# EAGLE design Freeduino4809 (EAGLE 7.7.0)

## Sheet 1 of 4
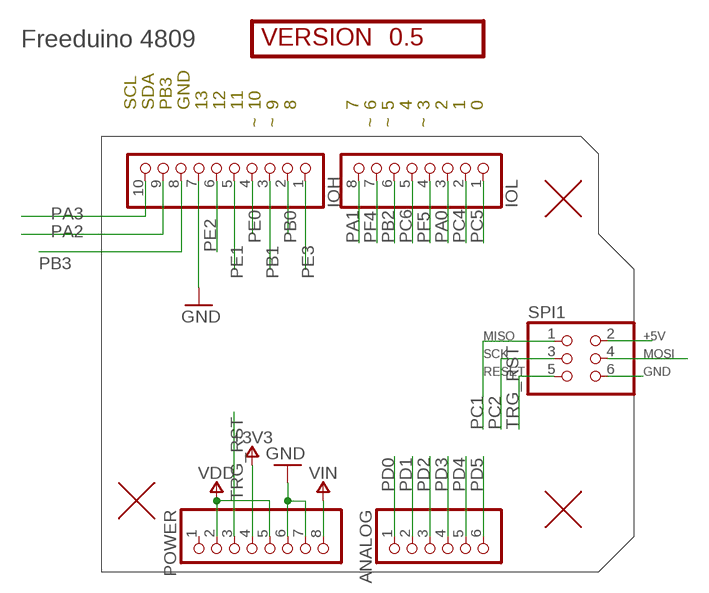
[diagram p0: schematic, sheet 1]

### Parts
ANALOG  Analog  PINHD-1X06TH  [1X06-TH]
IOH  Digital  PINHD-1X10TH  [1X10]
IOL  Digital  PINHD-1X08-DIGITALTH  [1X08]
POWER  Power  PINHD-1X08-POWERTH  [1X08]
SPI1  -  PINHD-2X03-ICSPTH  [2X03]
U$1  FIDUCIAL1.5X3  [FIDUCIAL-1.5X3]
U$2  FIDUCIAL1.5X3  [FIDUCIAL-1.5X3]
U$3  FIDUCIAL1.5X3  [FIDUCIAL-1.5X3]
VERSION  0.5  VERSION  [VERSION-NUMBER]

### Nets
+3V3: POWER.4 ; also sheet 4
GND: IOH.7 POWER.6 POWER.7 SPI1.6 ; also sheet 2,3,4
PA0: IOL.3 ; also sheet 2
PA1: IOL.8 ; also sheet 2
PA2: IOH.9 ; also sheet 2
PA3: IOH.10 ; also sheet 2
PB0: IOH.2 ; also sheet 2
PB1: IOH.3 ; also sheet 2
PB2: IOL.6 ; also sheet 2
PB3: IOH.8 ; also sheet 2
PC0: SPI1.4 ; also sheet 2
PC1: SPI1.1 ; also sheet 2
PC2: SPI1.3 ; also sheet 2
PC4: IOL.2 ; also sheet 2
PC5: IOL.1 ; also sheet 2
PC6: IOL.5 ; also sheet 2
PD0: ANALOG.1 ; also sheet 2
PD1: ANALOG.2 ; also sheet 2
PD2: ANALOG.3 ; also sheet 2
PD3: ANALOG.4 ; also sheet 2
PD4: ANALOG.5 ; also sheet 2
PD5: ANALOG.6 ; also sheet 2
PE0: IOH.4 ; also sheet 2
PE1: IOH.5 ; also sheet 2
PE2: IOH.6 ; also sheet 2
PE3: IOH.1 ; also sheet 2
PF4: IOL.7 ; also sheet 2
PF5: IOL.4 ; also sheet 2
TRG_RST: POWER.3 SPI1.5 ; also sheet 2,3
VDD [power]: POWER.2 POWER.5 SPI1.2 ; also sheet 2,3,4
VIN_EXT [power]: POWER.8 ; supply symbol labelled VIN ; also sheet 4
Unconnected: POWER.1

### Notes on the sheet
- Freeduino 4809
- SCL | SDA | PB3 | GND | 13 | 12 | 11 | 10 | 9 | 8 | 7 | 6 | 5 | 4 | 3 | 2 | 1 | 0
- ~ | ~ | ~ | ~ | ~

## Sheet 2 of 4
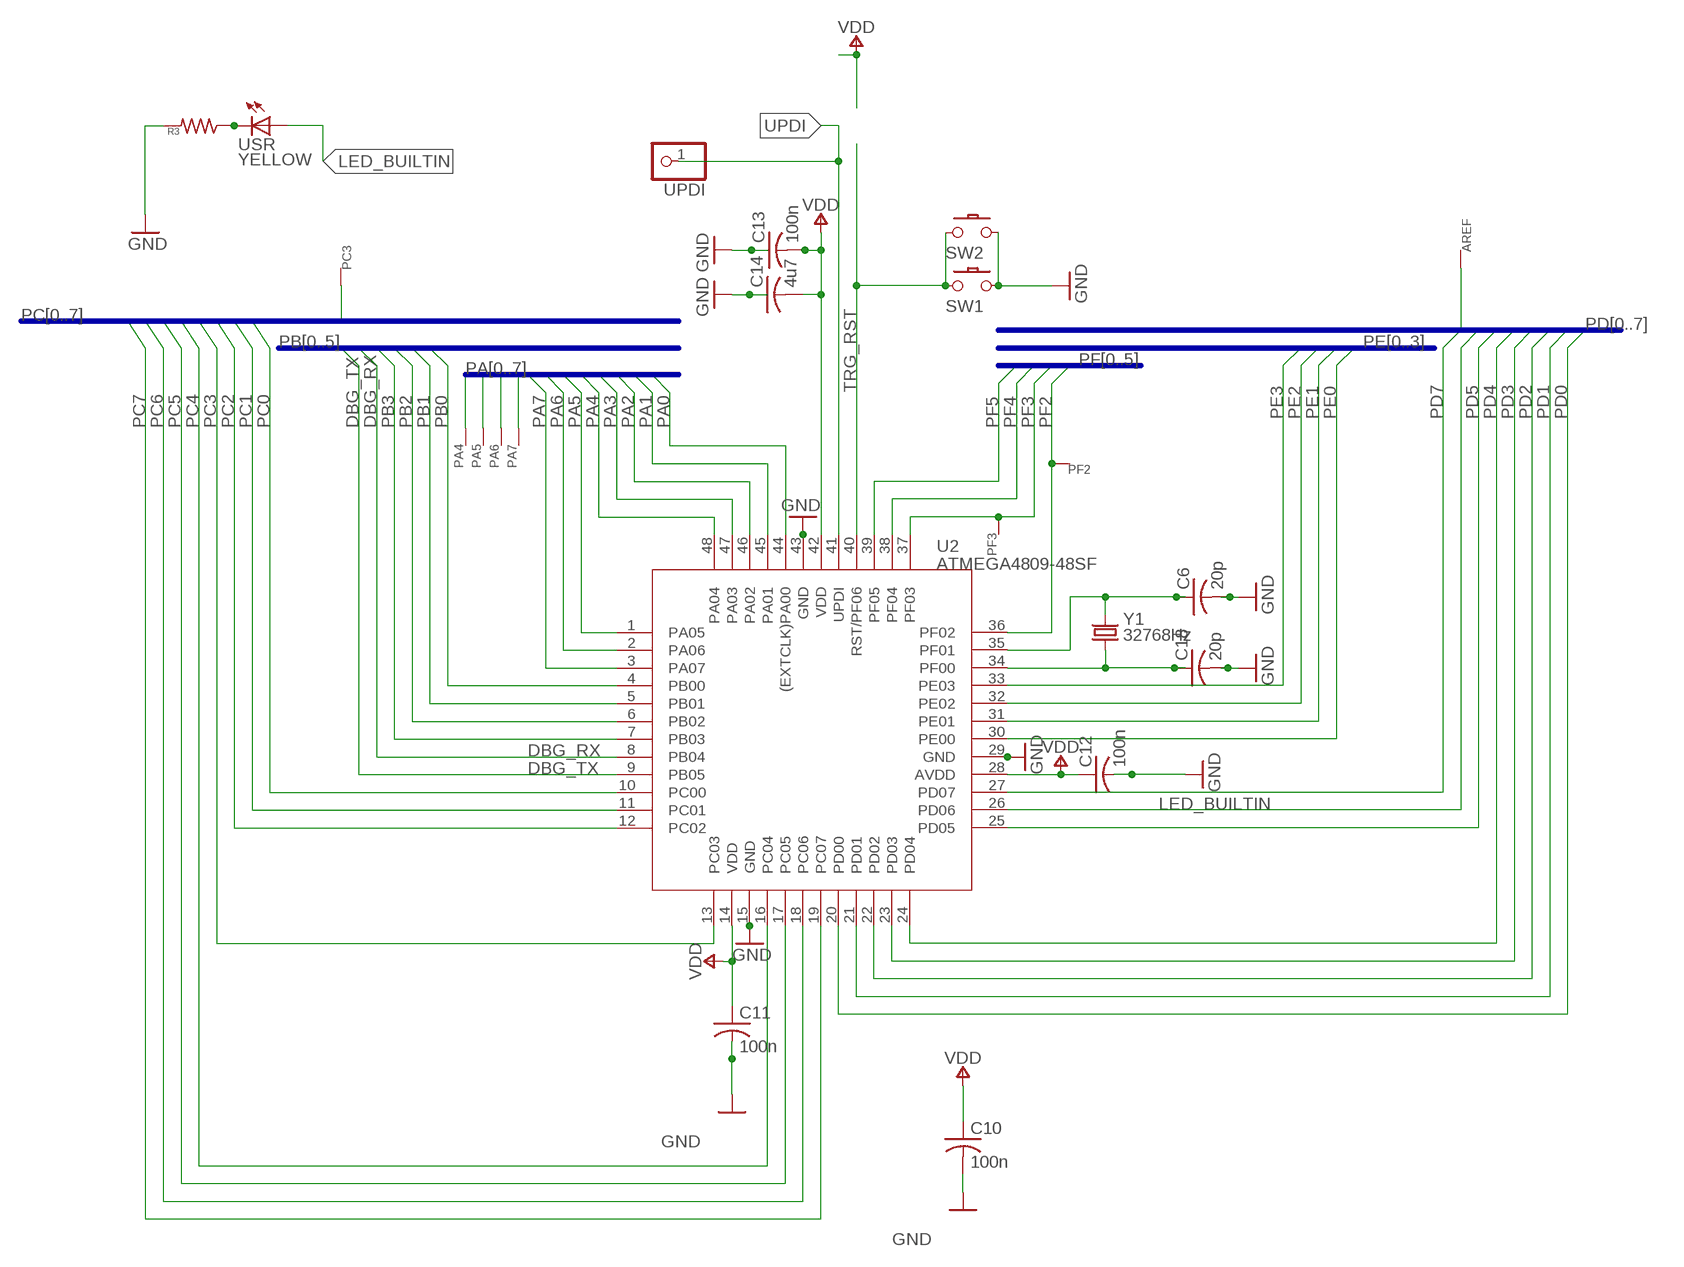
[diagram p1: schematic, sheet 2]

### Parts
AREF  WIRE-R10  [VIA10]
C6  20p  C-USC0805  [C0805]
C10  100n  C-USC0805  [C0805]
C11  100n  C-USC0805  [C0805]
C12  100n  C-USC0805  [C0805]
C13  100n  C-USC0805  [C0805]
C14  4u7  C-USC0805  [C0805]
C18  20p  C-USC0805  [C0805]
PA4  WIRE-R6  [VIA6]
PA5  WIRE-R6  [VIA6]
PA6  WIRE-R6  [VIA6]
PA7  WIRE-R6  [VIA6]
PC3  WIRE-R6  [VIA6]
PF2  WIRE-R6  [VIA6]
PF3  WIRE-R6  [VIA6]
R3  R-US_R0805  [R0805]
SW1  SW-PB2-NS/4MM  [SW-PB-SMT4MM]
SW2  SW-PB2-NSS52MM\  [SW-PB-SMT52MM]
U2  ATMEGA4809-48SF  [LQFP48-SPARKFUN]
UPDI  PINHD-1X1  [1X01]
USR  YELLOW  LED-YELLOW-0805  [CHIPLED_0805]
Y1  32768Hz  32.768KHZ  [ABS07]

### Nets
DBG_RX: U2.8(PB04) ; also sheet 3
DBG_TX: U2.9(PB05) ; also sheet 3
GND: C6.2 C10.2 C11.2 C12.2 C13.1 C14.1 C18.2 R3.2 SW1.P$4 SW2.S1 U2.15(GND) U2.29(GND) U2.43(GND) ; also sheet 1,3,4
LED_BUILTIN: U2.26(PD06) USR.A
N$4: C18.1 U2.34(PF00) Y1.1
N$5: C6.1 U2.35(PF01) Y1.2
N$22: R3.1 USR.C
PA0: U2.44((EXTCLK)PA00) ; also sheet 1
PA1: U2.45(PA01) ; also sheet 1
PA2: U2.46(PA02) ; also sheet 1
PA3: U2.47(PA03) ; also sheet 1
PA4: PA4.P$1 U2.48(PA04)
PA5: PA5.P$1 U2.1(PA05)
PA6: PA6.P$1 U2.2(PA06)
PA7: PA7.P$1 U2.3(PA07)
PB0: U2.4(PB00) ; also sheet 1
PB1: U2.5(PB01) ; also sheet 1
PB2: U2.6(PB02) ; also sheet 1
PB3: U2.7(PB03) ; also sheet 1
PC0: U2.10(PC00) ; also sheet 1
PC1: U2.11(PC01) ; also sheet 1
PC2: U2.12(PC02) ; also sheet 1
PC3: PC3.P$1 U2.13(PC03)
PC4: U2.16(PC04) ; also sheet 1
PC5: U2.17(PC05) ; also sheet 1
PC6: U2.18(PC06) ; also sheet 1
PC7: U2.19(PC07)
PD0: U2.20(PD00) ; also sheet 1
PD1: U2.21(PD01) ; also sheet 1
PD2: U2.22(PD02) ; also sheet 1
PD3: U2.23(PD03) ; also sheet 1
PD4: U2.24(PD04) ; also sheet 1
PD5: U2.25(PD05) ; also sheet 1
PD7: AREF.P$1 U2.27(PD07)
PE0: U2.30(PE00) ; also sheet 1
PE1: U2.31(PE01) ; also sheet 1
PE2: U2.32(PE02) ; also sheet 1
PE3: U2.33(PE03) ; also sheet 1
PF2: PF2.P$1 U2.36(PF02)
PF3: PF3.P$1 U2.37(PF03)
PF4: U2.38(PF04) ; also sheet 1
PF5: U2.39(PF05) ; also sheet 1
TRG_RST: SW1.P$2 SW2.C2 U2.40(RST/PF06) ; also sheet 1,3
UPDI: U2.41(UPDI) UPDI.1
VDD [power]: C10.1 C11.1 C12.1 C13.2 C14.2 U2.14(VDD) U2.28(AVDD) U2.42(VDD) ; also sheet 1,3,4

### Buses
PA[0..7]
PB[0..5]
PF[0..5]
PE[0..3]
PD[0..7]
PC[0..7]

## Sheet 3 of 4
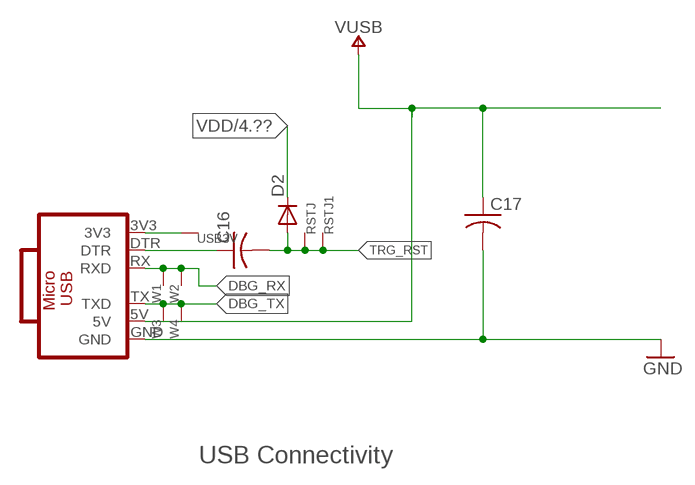
[diagram p2: schematic, sheet 3]

### Parts
C16  C-USC0805  [C0805]
C17  C-USC0805  [C0805]
D2  DIODE-SIGNAL-SOD323  [SOD323F]
RSTJ  WIRE-R6  [VIA6]
RSTJ1  WIRE-R6  [VIA6]
USB3V  WIRE-VIA8  [VIA8]
USBMOD  CH340E-MODNOHOLES  [CH340E-MOD-NOHOLES]
W1  WIRE-R6  [VIA6]
W2  WIRE-R6  [VIA6]
W3  WIRE-R6  [VIA6]
W4  WIRE-R6  [VIA6]

### Nets
DBG_RX: USBMOD.RX(RXD) W1.P$1 W2.P$1 ; also sheet 2
DBG_TX: USBMOD.TX(TXD) W3.P$1 W4.P$1 ; also sheet 2
DTR: C16.1 USBMOD.DTR
GND: C17.2 USBMOD.GND ; also sheet 1,2,4
TRG_RST: C16.2 D2.A RSTJ1.P$1 RSTJ.P$1 ; also sheet 1,2
USB3V: USB3V.P$1 USBMOD.3V3
VDD [power]: D2.C ; also sheet 1,2,4
VUSB: C17.1 USBMOD.5V ; also sheet 4

### Notes on the sheet
- USB Connectivity

## Sheet 4 of 4
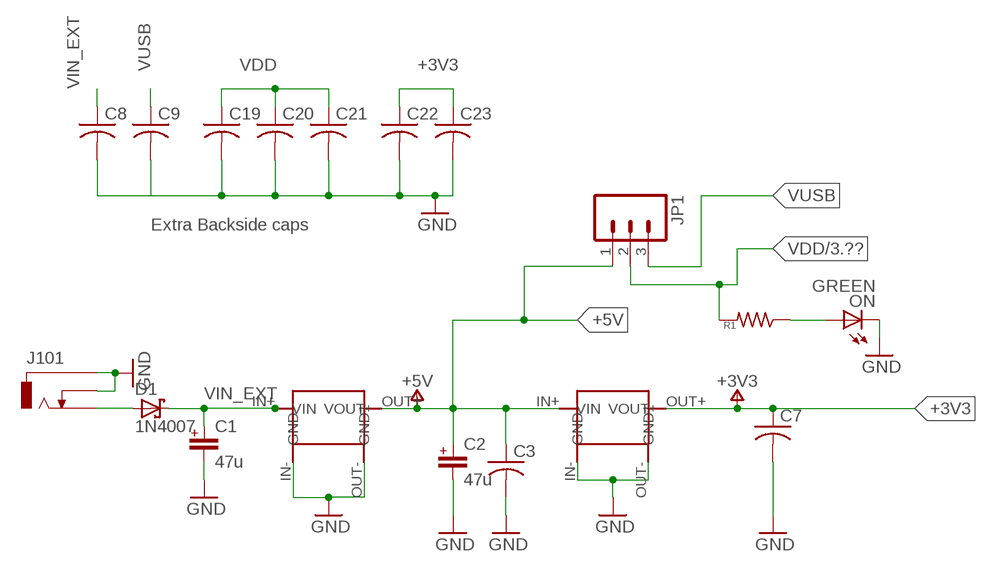
[diagram p3: schematic, sheet 4]

### Parts
C1  47u  C+-47UFPAN-D  [PANASONIC_D]
C2  47u  C+-47UFPAN-D  [PANASONIC_D]
C3  C-USC0805  [C0805]
C7  C-USC0805  [C0805]
C8  C-USC0805  [C0805]
C9  C-USC0805  [C0805]
C19  C-USC1206  [C1206]
C20  C-USC1206  [C1206]
C21  C-USC0805  [C0805]
C22  C-USC1206  [C1206]
C23  C-USC0805  [C0805]
D1  1N4007  D_SCHOTTKY-4007-SMB  [SMB_DO214AA]
J101  -  BARRELLG  [POWERSUPPLY_DC-21MM]
JP1  M03LOCK_LONGPADS  [1X03_LOCK_LONGPADS]
ON  GREEN  LED-GREEN-0805  [CHIPLED_0805]
R1  R-US_R0805  [R0805]
VREG-3V3  VREG-4-MOD  [VREG-4-11X17]
VREG-5V  VREG-4-MOD  [VREG-4-11X17]

### Nets
+3V3: C7.1 C22.1 C23.1 VREG-3V3.OUT+(VOUT) ; also sheet 1
+5V: C2.+ C3.1 JP1.1 VREG-3V3.IN+(VIN) VREG-5V.OUT+(VOUT)
GND: C1.- C2.- C3.2 C7.2 C8.2 C9.2 C19.2 C20.2 C21.2 C22.2 C23.2 J101.-1 J101.-2 J101.-3 J101.E1 J101.E2 J101.E3 ON.C VREG-3V3.IN-(GND) VREG-3V3.OUT-(GND1) VREG-5V.IN-(GND) VREG-5V.OUT-(GND1) ; also sheet 1,2,3
N$1: D1.A J101.+1 J101.+2 J101.+3
N$2: ON.A R1.1
VDD [power]: C19.1 C20.1 C21.1 JP1.2 R1.2 ; also sheet 1,2,3
VIN_EXT [power]: C1.+ C8.1 D1.C VREG-5V.IN+(VIN) ; also sheet 1
VUSB: C9.1 JP1.3 ; also sheet 3

### Notes on the sheet
- Extra Backside caps

## Library data of the parts
ANALOG = Arduino-connectors:PINHD-1X06: PIN HEADER; CODE-ARDUINO: 3649; DATASHEET: -; DISTRIBUTOR-LINK: -; DISTRIBUTOR-PN: -; MANUFACTURER: -; MANUFACTURER-PN: FH254-106DF085149V
AREF PA4-PA7 PC3 PF2 PF3 RSTJ RSTJ1 USB3V W1-W4 = mylib4:WIRE: Pad for a wire offboard
C1 C2 = Arduino-rcl:C+: Polarized Capacitor; CODE-ARDUINO: 0113; DATASHEET: https://industrial.panasonic.com/cdbs/www-data/pdf/RDE0000/DME0000COL90.pdf; DISTRIBUTOR-LINK: https://www.digikey.com/product-detail/en/panasonic-electronic-components/EEE-1EA470WP/PCE3908CT-ND/766284; DISTRIBUTOR-PN: PCE3908CT-ND; MANUFACTURER: Panasonic; MANUFACTURER-PN: EEE-1EA470WP; PN-ALTERNATIVE1: TS13C01E470MET000R
C3 C6-C14 C16-C23 = my-rcl:C-US: CAPACITOR, American symbol
D1 = Arduino-diodes:D_SCHOTTKY: Schottky Diodes; CODE-ARDUINO: 0020; DATASHEET: www.comchiptech.com/cms/UserFiles/CGRA4001-G%20Thru.%20CGRA4007-HF%20RevD.pdf; DISTRIBUTOR-LINK: https://www.digikey.com/product-detail/en/comchip-technology/CGRA4007-G/641-1018-1-ND/1121140; DISTRIBUTOR-PN: 641-1018-1-ND; MANUFACTURER: Comchip; MANUFACTURER-PN: CGRA4007-G; PN-ALTERNATIVE1: 1N4007SMA
D2 = mylib4:DIODE-SIGNAL
IOH = Arduino-connectors:PINHD-1X10: PIN HEADER; CODE-ARDUINO: 3648; DATASHEET: -; DISTRIBUTOR-LINK: -; DISTRIBUTOR-PN: -; MANUFACTURER: -; MANUFACTURER-PN: FH254-110DF085149V
IOL = Arduino-connectors:PINHD-1X08: PIN HEADER; CODE-ARDUINO: 3648; DATASHEET: -; DISTRIBUTOR-LINK: -; DISTRIBUTOR-PN: -; MANUFACTURER: -; MANUFACTURER-PN: FH254-108DF085149V
J101 = Arduino-connectors:BARREL: Power Barrel Connector Jack 2.10mm ID (0.083"), 5.50mm OD (0.217") Through Hole, Right Angle; CODE-ARDUINO: 0018; DATASHEET: http://www.mouser.com/ds/2/253/KC-301287-195995.pdf; DISTRIBUTOR-LINK: https://www.mouser.it/ProductDetail/Kobiconn/163-179PH-EX/?qs=Xb8IjHhkxj5l2UOaIqcGCw==; DISTRIBUTOR-PN: 163-179PH-EX; MANUFACTURER: Kobiconn; MANUFACTURER-PN: 163-179PH-EX
JP1 = SparkFun:M03: Header 3 Standard 3-pin 0.1" header. Use with straight break away headers (SKU : PRT-00116), right angle break away headers (PRT-00553), swiss pins (PRT-00743), machine pins (PRT-00117), and female headers (PRT-00115). Molex polarized connector foot print use with SKU : PRT-08232 with associated crimp pins and housings.
ON = Arduino-diodes:LED: LED; CODE-ARDUINO: 0043; DATASHEET: https://media.digikey.com/pdf/Data%20Sheets/Lite-On%20PDFs/LTST-C170GKT.pdf; DISTRIBUTOR-LINK: https://www.digikey.com/product-detail/it/lite-on-inc/LTST-C170GKT/160-1179-1-ND/269251; DISTRIBUTOR-PN: 160-1179-1-ND; MANUFACTURER: Lite-On; MANUFACTURER-PN: LTST-C170GKT; PN-ALTERNATIVE1: KPT-2012SGC
POWER = Arduino-connectors:PINHD-1X08: PIN HEADER; CODE-ARDUINO: 3649; DATASHEET: -; DISTRIBUTOR-LINK: -; DISTRIBUTOR-PN: -; MANUFACTURER: -; MANUFACTURER-PN: FH254-108DF085149V
R1 R3 = my-rcl:R-US_: RESISTOR, American symbol
SPI1 = Arduino-connectors:PINHD-2X03-ICSP: PIN HEADER; CODE-ARDUINO: 0114; DATASHEET: -; DISTRIBUTOR-LINK: https://www.digikey.com/product-detail/en/samtec-inc/TSW-103-25-S-D/TSW-103-25-S-D-ND/7863771; DISTRIBUTOR-PN: TSW-103-25-S-D-ND; MANUFACTURER: Samtec; MANUFACTURER-PN: TSW-103-25-S-D
SW1 SW2 = mylib4:SW-PB2-NS: SPST switch with no shield
U2 = avr:ATMEGA4809-48: ATMEGA4809
U$1-U$3 = SparkFunEagle-6-6-07:FIDUCIAL: Fiducial Alignment Points Various fiducial points for machine vision alignment.
UPDI = pinhead:PINHD-1X1: PIN HEADER
USBMOD = mini-usb:CH340E-MOD
USR = Arduino-diodes:LED: LED; CODE-ARDUINO: 0044; DATASHEET: https://media.digikey.com/pdf/Data%20Sheets/Lite-On%20PDFs/LTST-C170GKT.pdf; DISTRIBUTOR-LINK: https://www.digikey.com/product-detail/it/lite-on-inc/LTST-C170YKT/160-1175-1-ND/269247; DISTRIBUTOR-PN: 160-1175-1-ND; MANUFACTURER: Lite-On; MANUFACTURER-PN: LTST-C170YKT; PN-ALTERNATIVE1: KPT-2012YC
VERSION = mylib4:VERSION: Version number for drawings
VREG-3V3 VREG-5V = mylib4:VREG-4-MOD
Y1 = Arduino-crystals:32.768KHZ: LF crystal; CODE-ARDUINO: 0213; DATASHEET: http://www.abracon.com/Resonators/ABS07.pdf; DISTRIBUTOR-LINK: http://www.digikey.com/product-detail/en/abracon-llc/ABS07-32.768KHZ-T/535-9542-1-ND/1237009; DISTRIBUTOR-PN: 535-9542-1-ND; MANUFACTURER: Abracon LLC; MANUFACTURER-PN: ABS07-32.768KHZ-T

## Net classes
0 default: width 0.2 mm, drill 0.5 mm
1 power: width 0.6 mm

## Board
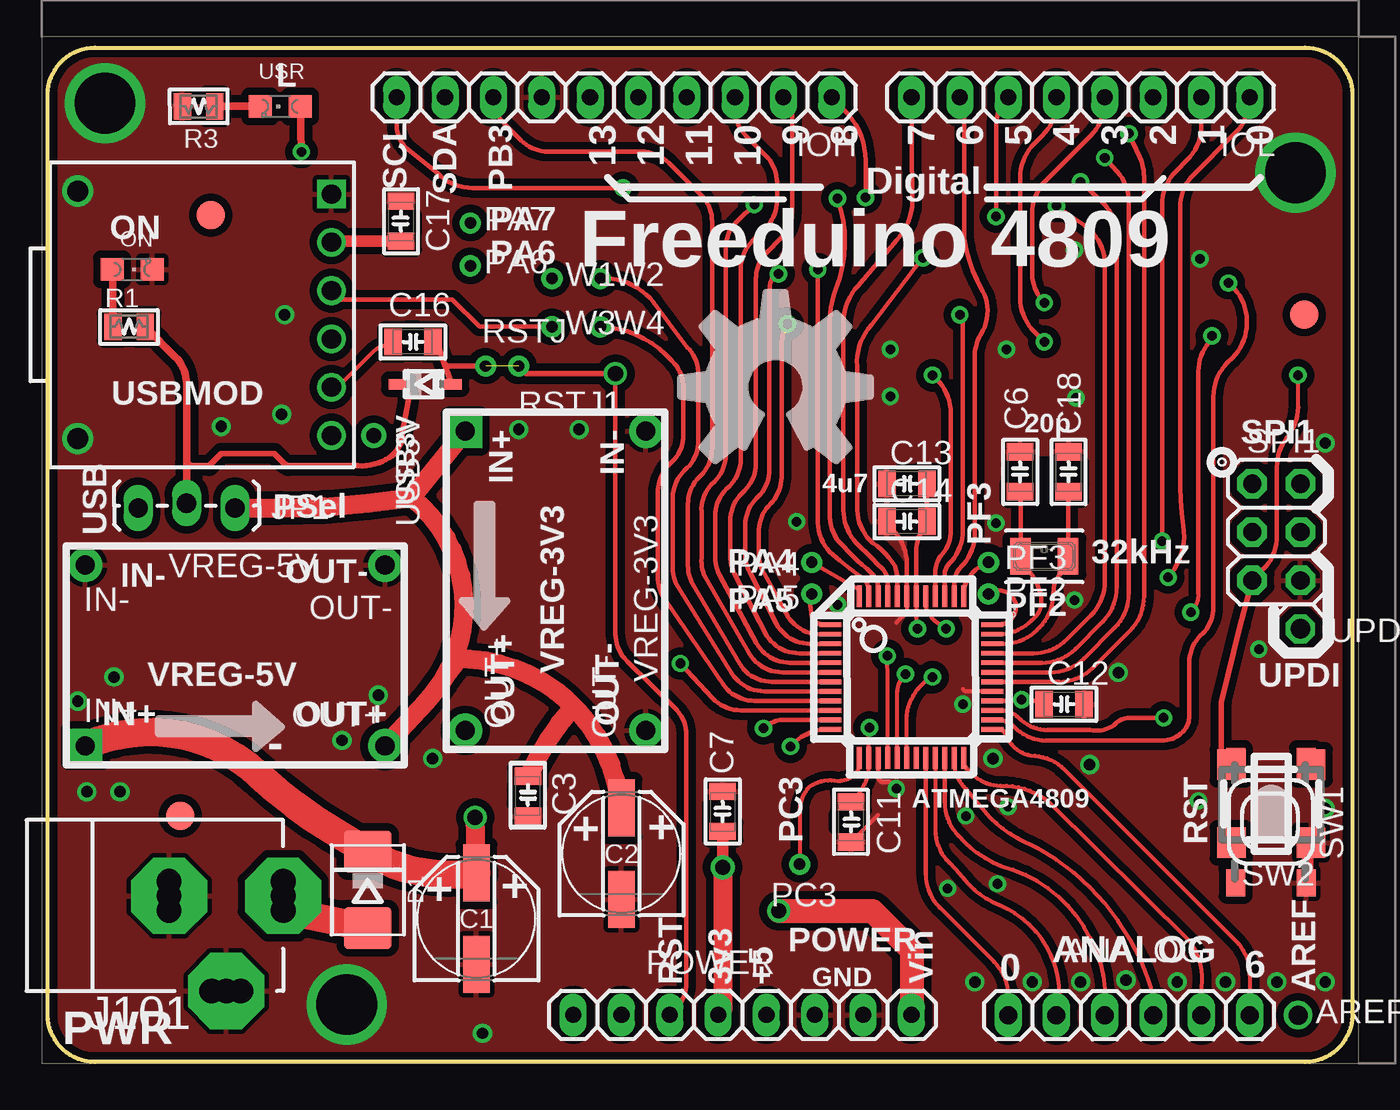
[diagram p4: board, top side]
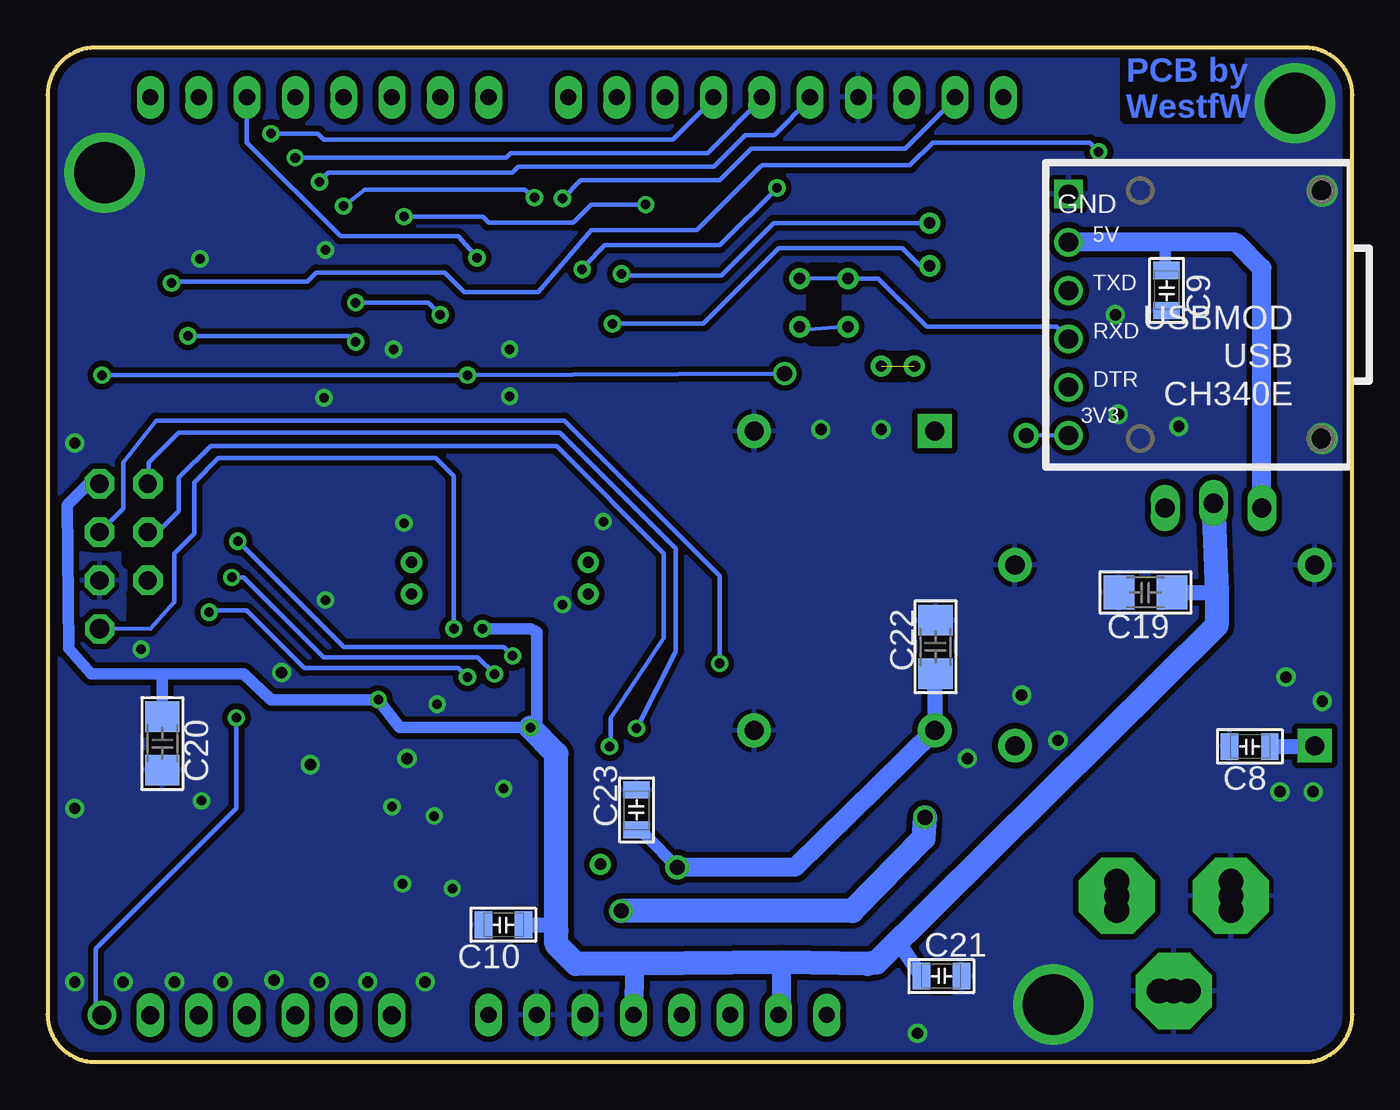
[diagram p5: board, bottom side, seen from below]

Size 68.58 x 53.34 mm. Coordinates in mm from the lower left corner, seen from the top.
Outline: 0,50.84 arc-90 2.5,53.34 66.08,53.34 arc-90 68.58,50.84 68.58,2.5 arc-90 66.08,0 2.5,0 arc-90 0,2.5 0,50.84
Copper layers (1*16): Top 0.035mm / dielectric 1.5mm / Bottom 0.035mm
Design rules "default *": minimum track width 8mil, minimum drill 0.3mm, track to track 6mil, track to pad 6mil, pad to pad 6mil, via to via 6mil, smd to smd 6mil, copper to edge 16mil, drill to drill 8mil, minimum pad ring 10mil, minimum via ring 8mil, stop-mask expansion 2mil, vias tented up to drill 0.55mm, thermal gap 10mil
tRestrict: area 52.1,25.6 to 52.8,30.5; area 50.5,30.7 to 51.8,31.4; area 53,30.8 to 54.4,31.5; area 51.8,30.7 to 53.1,31.4; area 44.8,29.7 to 45.5,31; area 44.8,27.8 to 45.6,29.1; area 18.8,37.2 to 19.5,38.6; area 17.9,43.8 to 19.3,44.5; area 34.8,12.8 to 36.1,13.5; area 41.4,12.3 to 42.8,13; area 24.5,13.6 to 25.9,14.3; area 3.9,38 to 4.6,39.3; area 53.1,18.2 to 53.8,19.5; area 53,18.1 to 53.7,19.4
bRestrict: area 10.5,24 to 11.3,25.2; area 9,40.1 to 10.3,40.9; area 4.9,16 to 5.7,17.2; area 21.3,21.5 to 22.5,22.3; area 21.2,3.8 to 22,5.1; area 37,12.9 to 38.3,13.7; area 44.2,6.6 to 45,7.9; area 61.8,16.4 to 63.1,17.1; area 30.7,4.6 to 37.1,5.6; area 23.6,36 to 24.4,37.1; area 27.1,37.9 to 28.4,41.8; 6 lines

### Footprints (pad centres in the part's own frame; a part is rotated, then mirrored left to right if it is on the bottom)
1X06-TH = drill 0.95 pad 1.422 long: 1 -6.35,0; 2 -3.81,0; 3 -1.27,0; 4 1.27,0; 5 3.81,0; 6 6.35,0
VIA10 = drill 1: P$1 0,0
PANASONIC_D = smd 3 x 1.4: + 2.4,0; - -2.4,0
C0805 = smd 0.914 x 1.397: 1 -1.053,0; 2 1.053,0
C1206 = smd 1.6 x 1.8: 1 -1.4,0; 2 1.4,0
SMB_DO214AA = smd 2.2 x 2.5: A -2,0; C 2,0
SOD323F = smd 0.55 x 1.05: A 0,-1.4; C 0,1.4
1X10 = drill 0.85 pad 1.422 long: 1 -11.43,0; 2 -8.89,0; 3 -6.35,0; 4 -3.81,0; 5 -1.27,0; 6 1.27,0; 7 3.81,0; 8 6.35,0; 9 8.89,0; 10 11.43,0
1X08 = drill 0.85 pad 1.422 long: 1 -8.89,0; 2 -6.35,0; 3 -3.81,0; 4 -1.27,0; 5 1.27,0; 6 3.81,0; 7 6.35,0; 8 8.89,0
POWERSUPPLY_DC-21MM = drill 1.3 pad 4 octagon: +1 -0.076,-6.35; -1 -0.076,-0.356; E1 -5.08,-3.353 | drill 1.3: +2 -0.838,-6.35; +3 0.686,-6.35; -2 -0.838,-0.356; -3 0.686,-0.356; E2 -5.08,-2.591; E3 -5.08,-4.115
1X03_LOCK_LONGPADS = drill 1.016 long: 1 0,0; 2 2.54,-0.254; 3 5.08,0
CHIPLED_0805 = smd 1.2 x 1.2: A -1.05,0; C 1.05,0
VIA6 = drill 0.6: P$1 0,0
R0805 = smd 0.914 x 1.397: 1 -0.85,0; 2 0.85,0
2X03 = drill 0.95 pad 1.55 octagon: 1 2.54,1.27; 2 2.54,-1.27; 3 0,1.27; 4 0,-1.27; 5 -2.54,1.27; 6 -2.54,-1.27
SW-PB-SMT4MM = smd 1.4 x 1: P$1 -3.2,1.85; P$2 -3.2,-1.85; P$3 3.2,-1.85; P$4 3.2,1.85
SW-PB-SMT52MM = smd 1.5 x 1.6: C1 2.1,2.05; C2 2.1,-2.05; S1 -2.1,2.05; S2 -2.1,-2.05
LQFP48-SPARKFUN = smd 0.254 x 1.143: 1 -2.75,-4.25; 2 -2.25,-4.25; 3 -1.75,-4.25; 4 -1.25,-4.25; 5 -0.75,-4.25; 6 -0.25,-4.25; 7 0.25,-4.25; 8 0.75,-4.25; 9 1.25,-4.25; 10 1.75,-4.25; 11 2.25,-4.25; 12 2.75,-4.25; 25 2.75,4.25; 26 2.25,4.25; 27 1.75,4.25; 28 1.25,4.25; 29 0.75,4.25; 30 0.25,4.25; 31 -0.25,4.25; 32 -0.75,4.25; 33 -1.25,4.25; 34 -1.75,4.25; 35 -2.25,4.25; 36 -2.75,4.25 | smd 1.143 x 0.254: 13 4.25,-2.75; 14 4.25,-2.25; 15 4.25,-1.75; 16 4.25,-1.25; 17 4.25,-0.75; 18 4.25,-0.25; 19 4.25,0.25; 20 4.25,0.75; 21 4.25,1.25; 22 4.25,1.75; 23 4.25,2.25; 24 4.25,2.75; 37 -4.25,2.75; 38 -4.25,2.25; 39 -4.25,1.75; 40 -4.25,1.25; 41 -4.25,0.75; 42 -4.25,0.25; 43 -4.25,-0.25; 44 -4.25,-0.75; 45 -4.25,-1.25; 46 -4.25,-1.75; 47 -4.25,-2.25; 48 -4.25,-2.75
FIDUCIAL-1.5X3 = smd 1.5 x 1.5: 1 0,0
1X01 = drill 1.016 octagon: 1 0,0
VIA8 = drill 0.8: P$1 0,0
CH340E-MOD-NOHOLES = drill 1: 3V3 6.35,6.35; 5V 6.35,-3.81; DTR 6.35,3.81; RX 6.35,1.27; TX 6.35,-1.27 | drill 1 square: GND 6.35,-6.35
VREG-4-11X17 = drill 1 pad 1.778 square: IN+ -5,-2.5 | drill 1 pad 1.778: IN- -5,7; OUT+ 10.75,-2.5; OUT- 10.75,7
ABS07 = smd 1.1 x 1.9: 1 -1.25,0; 2 1.25,0

### Placement (x,y rotation side)
ANALOG  56.83,2.46 0 top
AREF  65.72,2.46 0 top
C1  22.54,7.54 90 top
C2  30.16,10.95 90 top
C3  25.24,13.97 270 top
C6  51.12,31.04 90 top
C7  35.48,13.18 90 top
C8  5.4,16.59 180 bottom
C9  9.76,40.56 270 bottom
C10  44.63,7.21 180 bottom
C11  42.23,12.62 270 top
C12  53.42,18.81 0 top
C13  45.16,30.4 0 top
C14  45.16,28.42 0 top
C16  19.21,37.86 0 top
C17  18.57,44.21 90 top
C18  53.66,31.04 90 top
C19  10.87,24.69 180 bottom
C20  62.55,16.75 270 bottom
C21  21.6,4.52 0 bottom
C22  21.91,21.83 90 bottom
C23  37.62,13.26 90 bottom
D1  16.83,9.05 90 top
D2  19.84,35.64 90 top
IOH  29.78,50.72 180 top
IOL  54.29,50.72 180 top
J101  6.03,8.81 90 top
JP1  9.84,29.13 180 top
ON  4.45,41.67 0 top
PA4  40.16,26.27 0 top
PA5  40.16,24.61 0 top
PA6  22.23,41.86 0 top
PA7  22.23,44.12 0 top
PC3  39.53,10.4 0 top
PF2  49.45,24.61 0 top
PF3  49.45,26.27 0 top
POWER  36.51,2.47 0 top
R1  4.29,38.66 0 top
R3  7.94,50.24 180 top
RSTJ  23.02,36.59 0 top
RSTJ1  24.77,36.59 0 top
SPI1  64.58,27.86 90 top
SW1  64.29,12.62 270 top
SW2  64.31,13.58 180 top
U2  45.4,20.24 270 top
U$1  6.99,12.94 0 top
U$2  66.04,39.29 0 top
U$3  8.57,44.53 0 top
UPDI  65.85,22.78 0 top
USB3V  17.14,32.94 0 top
USBMOD  8.57,39.29 180 bottom
USR  12.22,50.24 180 top
VERSION  33.03,57.96 0 top  (outside the outline)
VREG-3V3  24.45,28.18 270 top
VREG-5V  6.99,19.13 0 top
W1  26.51,41.2 0 top
W2  29.05,41.2 0 top
W3  26.51,38.66 0 top
W4  29.05,38.66 0 top
Y1  52.39,26.59 180 top

### Tracks (layer width: path | path; a pad name or v marks a point on that pad's centre or on a via)
+3V3  (via drill 0.8 pad 1.27)
  Top 0.6: C7.1 v35.48,10.24
  Top 1: v35.48,10.24 35.48,2.71 POWER.4
  Bottom 0.6: C22.1 arc-90 21.95,19.46 | C23.1 37.13,11.88 v35.48,10.24
  Bottom 0.8: 21.95,19.46 VREG-3V3.OUT+
  Bottom 1: VREG-3V3.OUT+ 29.29,10.24 v35.48,10.24
+5V
  Top 0.6: 29.85,14.84 28.34,17.86 27.54,18.57 | 30.24,13.33 C2.+
  Top 1: C2.+ 30.24,13.35 | JP1.1 12.22,29.13 arc9 19.13,29.69 | VREG-5V.OUT+ 19.92,18.97 | 19.92,18.97 arc95 19.13,29.69 | 19.13,29.69 VREG-3V3.IN+ | 30.24,13.33 29.85,14.84 arc77 21.35,21.19 21.35,20.88 19.92,18.97 | C3.1 25.4,15.24 arc-17 27.54,18.57
DBG_RX
  Top 0.229: W2.P$1 arc-55 31.86,39.93 33.62,37.57 arc-45 34.21,36.16 34.21,32.66 arc-45 33.62,31.24 33.45,31.07 arc45 32.86,29.65 32.86,25.97 arc32 33.16,24.91 35.96,20.43 arc58 37.66,19.49 U2.8
  Bottom 0.2: W1.P$1 W2.P$1
  Bottom 0.229: W1.P$1 24.92,41.2 22.38,38.66 15.56,38.66 USBMOD.RX
DBG_TX
  Top 0.229: W4.P$1 arc-48 32.83,36.86 arc-45 33.42,35.45 33.42,32.98 arc-45 32.83,31.56 32.73,31.46 arc45 32.07,30.05 32.07,25.38 arc34 32.5,24.25 35.5,19.86 arc56 37.15,18.99 U2.9 | W3.P$1 22.7,38.66 21.27,40.08 15.4,40.08 USBMOD.TX
  Bottom 0.2: W3.P$1 28.58,38.51 arc-90 W4.P$1
DTR
  Top 0.203: USBMOD.DTR 15.24,35.48 17.08,37.33 arc-45 18,37.7 C16.1
GND  (via drill 0.5, 0.6, 1.1, 3.2)
  Top 0.203: 43.65,12.99 C11.2 | U2.29 48.22,19.49 48.1,19.61 | U2.43 45.15,23.64 44.61,23.1
  Top 0.229: 45.15,26.24 arc45 44.45,27.94 arc45 44.35,28.17 C14.1 | U2.15 43.65,14.89 43.82,14.72 44.26,14.72 v44.61,14.37 | U2.43 45.15,25.65 45.15,26.44
  Top 0.6: SW2.S1 arc90 66.22,11.33 66.22,9.29
  other vias: 54.29,4.21 56.68,4.31 59.37,4.21 61.91,4.21 47.31,9.13 49.69,15.95 50.48,13.41 48.26,12.94 51.75,4.21 49.93,9.37 54.77,15.64 56.28,20.48 64.61,4.21 48.74,4.21 41.51,24.05 48.1,18.81 44.29,37.47 44.29,35 54.05,34.93 50.4,37.47 53.97,42.7 60.56,42.23 39.37,28.42 49.85,28.34 53.97,24.29 1.59,45.8 1.59,32.78 67.15,4.21 67.15,13.34 67.15,32.54 1.59,18.97 3.49,20.24 3.81,14.21 2.06,14.21 22.86,1.51 24.77,33.26 27.94,33.26 20.24,15.95 60.48,13.73 9.13,33.42 12.3,34.05 12.46,39.29 17.38,19.29 15.48,16.91 3.02,50.42 65.58,46.77 15.72,3.02 63.66,21.71
  pour Top (isolate 0.4): -2.86,55.8 72.71,55.8 72.71,-3.25 -2.86,-3.25
  pour Bottom (isolate 0.3): -0.64,55.17 70.17,55.17 70.17,-1.98 -0.64,-1.98 -0.64,53.26
LED_BUILTIN  (via drill 0.5)
  Top 0.203: 49.93,17.99 arc-45 50.78,17.64 arc45 52.47,16.91
  Top 0.229: v62.07,40.96 62.21,40.83 arc-47 63.02,38.98 63.02,38.82 arc-45 62.29,37.05 62.01,36.77 arc45 61.28,35 61.28,23.93 arc-45 60.69,22.51 60.59,22.41 arc45 60.01,21 60.01,18.19 arc-45 59.66,17.36 arc-45 58.58,16.91 52.47,16.91 | U2.26 49.93,17.99
  Top 0.4: USR.A v13.33,47.86
  Bottom 0.229: v62.07,40.96 62.07,41.04 54.93,41.04 54.45,41.51 47.7,41.51 46.67,40.48 42.78,40.48 40,43.74 34.45,43.74 31.09,47.09 arc45 30.96,47.15 23.26,47.15 22.07,48.34 13.81,48.34 v13.33,47.86
N$1
  Top 1.5: J101.+2 D1.A
  Bottom 0.2: J101.+2 J101.+1 | J101.+3 J101.+1 | 12.38,7.94 J101.+1
N$2
  Top 0.4: ON.A 3.44,40.84 R1.1
N$4
  Top 0.203: 50.24,21.99 arc45 52.01,22.72 52.13,22.84 arc45 52.86,24.61 52.86,24.65
  Top 0.229: C18.1 53.64,29.96 Y1.1 53.34,26.29 53.34,25.8 arc45 52.86,24.65 | U2.34 50.24,21.99
N$5
  Top 0.203: 49.95,22.49 arc45 51.72,23.22 51.95,23.45 arc45 52.23,24.13
  Top 0.229: C6.1 51.14,29.96 Y1.2 51.43,26.29 51.43,25.96 51.5,25.89 arc-45 52.23,24.13 | U2.35 49.95,22.49
N$22
  Top 0.4: R3.1 USR.C
PA0  (via drill 0.5)
  Top 0.229: v46.01,42.28 43.31,38.78 arc46 42.54,36.58 42.54,29.23 arc49 43.36,27.29 arc-26 44.55,26.05 44.65,25.55 U2.44
  Bottom 0.229: IOL.3 58.1,48.34 53.18,43.42 46.99,43.42 v46.01,42.28
PA1
  Top 0.229: IOL.8 45.45,45.54 arc-46 44.63,43.22 42.6,40.83 arc46 41.83,38.72 41.83,29.01 arc43 42.51,27.3 42.74,27.05 arc-2 43.64,26.17 43.86,25.95 arc-45 44.15,25.24 U2.45
PA2  (via drill 0.5)
  Top 0.229: v41.51,45.4 arc-41 41.43,40.64 arc22 41.12,38.97 41.12,29.02 arc44 41.57,27.37 42.34,26.57 arc7 43.06,25.94 43.36,25.64 arc-45 43.65,24.95 U2.46
  Bottom 0.229: 41.47,45.44 v41.51,45.4 40.56,46.35 33.26,46.35 31.59,48.02 23.49,48.02 20.96,50.56 20.96,50.72 IOH.9
PA3  (via drill 0.5)
  Top 0.203: 43.14,24.65 43.16,24.9
  Top 0.229: v40.48,41.67 40.48,28.55 arc44 41.1,26.82 arc2 42.7,25.52 arc-53 43.16,24.9 | v30.24,45.96 22.32,45.96 arc-45 20.53,46.7 18.81,48.1 arc-45 18.35,49.38 IOH.10 | U2.47 43.15,24.56 43.14,24.65
  Bottom 0.229: v40.48,41.67 40.32,41.91 39.29,42.94 33.26,42.94 v30.24,45.96
PA4
  Top 0.229: PA4.P$1 42.62,24.84 42.65,24.82 U2.48
PA5
  Top 0.229: PA5.P$1 arc27 40.16,23.42 arc73 40.64,23.02 40.64,22.99 U2.1
PA6  (via drill 0.5)
  Top 0.229: v38.89,38.81 38.84,38.72 arc30 38.58,37.73 38.58,30.75 arc-45 37.99,29.34 37.89,29.24 arc45 37.39,27.83 37.39,26.93 arc28 37.54,25.91 38.66,23.89 38.81,23.58 arc63 40.6,22.49 U2.2
  Bottom 0.229: PA6.P$1 22.73,41.86 23.65,42.78 30.16,42.78 34.13,38.81 v38.89,38.81
PA7  (via drill 0.5)
  Top 0.229: v38.42,41.43 38.15,41.38 arc27 37.94,40.49 37.94,31.15 arc-45 37.36,29.74 37.26,29.64 arc45 36.67,28.22 36.67,26.68 arc27 36.9,25.76 38.29,23.07 arc63 40.07,21.99 U2.3
  Bottom 0.229: PA7.P$1 30.42,44.12 33.18,41.35 38.5,41.35 v38.42,41.43
PB0
  Top 0.229: IOH.2 arc-45 39.13,49.61 39.13,44.72 arc-45 38.55,43.31 37.81,42.58 arc45 37.23,41.16 37.23,31.47 arc-45 36.64,30.05 36.46,29.88 arc45 35.88,28.46 35.88,26.6 arc27 36.1,25.68 37.72,22.57 arc63 39.49,21.49 U2.4
PB1
  Top 0.229: IOH.3 36.12,50.7 36.12,50.12 arc45 36.7,48.71 37.75,47.66 arc-45 38.34,46.24 38.34,45.28 arc-45 37.75,43.86 37.02,43.13 arc45 36.43,41.72 36.43,31.71 arc-45 35.85,30.29 35.67,30.11 arc45 35.08,28.7 35.08,26.54 arc29 35.33,25.59 37.26,22.04 arc61 39.02,20.99 U2.5
PB2  (via drill 0.5)
  Top 0.229: v49.85,44.45 49.85,49.19 arc-45 IOL.6 | v37.15,45.08 36.26,44.25 arc47 35.64,42.8 35.64,31.94 arc-45 35.05,30.53 34.88,30.35 arc45 34.37,28.94 34.37,26.49 arc30 34.56,25.49 36.88,21.49 arc60 38.61,20.49 U2.6
  Bottom 0.229: v37.15,45.08 40,45.08 40.96,44.13 45.4,44.13 45.72,44.45 v49.85,44.45
PB3
  Top 0.229: IOH.8 arc45 24,49.34 24.89,48.45 arc45 26.31,47.86 31.24,47.86 arc-45 32.65,47.28 34.34,45.59 arc-45 34.92,44.18 34.92,32.26 arc-45 34.34,30.85 34.24,30.75 arc45 33.65,29.33 33.65,26.1 arc30 33.93,25.09 36.34,20.98 arc60 38.07,19.99 U2.7
PC0  (via drill 0.5)
  Top 0.229: v33.26,20.95 34.97,19.12 arc47 36.43,18.49 U2.10
  Bottom 0.229: v33.26,20.95 33.26,25.56 41.43,33.73 62.86,33.73 64.61,31.51 64.61,29.1 SPI1.4
PC1  (via drill 0.5)
  Top 0.229: v37.62,17.54 arc-29 38.28,17.93 arc-16 38.71,17.99 U2.11
  Bottom 0.229: SPI1.1 63.26,30.45 63.26,31.51 61.67,33.1 41.67,33.1 35.56,26.99 35.56,21.59 v37.62,17.54
PC2  (via drill 0.5)
  Top 0.229: v39.05,16.59 39.22,16.76 arc-20 39.91,17.25 | 39.91,17.25 arc-25 40.99,17.49 U2.12 | 39.93,17.22 39.91,17.25
  Bottom 0.229: 62.86,27.86 SPI1.3 62.79,27.86 61.67,28.97 61.67,30.72 60.01,32.38 41.83,32.38 36.2,26.75 36.2,22.3 38.97,18.1 38.97,16.67 v39.05,16.59
PC3
  Top 0.203: 42.65,15.65 arc-45 42.44,15.13 arc-45 41.55,14.76 arc45 40.02,14.46 arc45 39.53,13.09 PC3.P$1
  Top 0.229: U2.13 42.65,15.65
PC4  (via drill 0.5)
  Top 0.203: U2.16 44.15,20.06 v44.13,21.35
  Top 0.229: IOL.2 60.64,49.22 arc-45 59.91,47.45 59.31,46.85 arc45 58.58,45.08 v58.58,27.38
  Bottom 0.229: v44.13,21.35 44.61,21.83 53.02,21.83 v58.58,27.38
PC5  (via drill 0.5)
  Top 0.203: U2.17 44.65,19.36 arc-45 v45.09,20.4
  Top 0.229: IOL.1 63.18,50.64 arc-45 62.45,48.88 60.1,46.53 arc45 59.53,44.68 59.53,30.24 arc9 59.69,28.18 arc-50 v58.9,25.48
  Bottom 0.229: v45.09,20.4 45.96,21.27 54.05,21.27 58.26,25.48 v58.9,25.48
PC6  (via drill 0.5)
  Top 0.203: 60.48,24.61 arc-45 v60.09,23.65 | U2.18 45.15,18 arc-45 45.88,19.77 46.35,20.24 v46.51,20.24
  Top 0.229: 60.48,24.61 60.48,36.3 arc-45 61.2,38.02 v61.2,38.18 | v52.39,37.86 51.85,38.4 arc-45 51.12,40.17 51.12,46.51 arc-45 51.85,48.28 52.29,48.72 arc45 53.02,50.49 IOL.5
  Bottom 0.229: v61.2,38.18 52.71,38.18 v52.39,37.86 | v46.51,20.24 46.99,20.72 55.09,20.72 58.1,23.73 60.01,23.73 v60.09,23.65
PD0
  Top 0.203: 46.15,9.89 arc45 46.88,8.12 49.75,5.26 arc-45 50.48,3.49 ANALOG.1
  Top 0.229: U2.20 46.15,9.89
PD1
  Top 0.203: 46.67,15.95 46.67,12.23 arc45 47.4,10.46 arc-6 48.18,9.6 arc28 50.01,8.25 arc-54 53.02,4.76 arc-28 ANALOG.2
  Top 0.229: U2.21 46.65,15.97 46.67,15.95
PD2
  Top 0.203: 47.15,13.65 arc45 47.88,11.88 arc27 50.09,10.32 arc-81 ANALOG.3
  Top 0.229: U2.22 47.15,13.65
PD3
  Top 0.203: ANALOG.4 58.15,3.27 arc52 51,11.77 arc-17 49.53,12.86 48.29,14.34 arc-45 47.64,15.8
  Top 0.229: U2.23 47.65,15.97 47.64,15.8
PD4
  Top 0.203: 48.42,15.32 48.6,15.14 arc45 50.08,14.53 arc-45 52.7,13.59 59.97,6.41 arc-45 60.64,3.96 ANALOG.5
  Top 0.229: U2.24 48.15,15.59 48.42,15.32
PD5
  Top 0.203: 50.38,17.1 50.55,16.83 arc45 51.67,16.11 arc-45 53.44,15.38 62.45,6.37 arc-45 63.18,4.6 ANALOG.6
  Top 0.229: U2.25 50,17.49 arc-90 50.38,17.1
PD7  (via drill 0.5)
  Top 0.203: 50.07,18.49 arc-45 51.02,18.12 arc45 52.55,17.46
  Top 0.229: 52.55,17.46 54.79,17.46 arc45 56.04,17.7 arc-45 56.84,18.1 v58.66,18.1 | U2.27 50.07,18.49
  Bottom 0.229: v58.66,18.1 58.66,13.33 66.04,5.95 66.04,2.78 AREF.P$1 65.56,2.46
PE0  (via drill 0.5)
  Top 0.203: 53.17,19.99 arc45 54.93,20.72 56.89,22.68 arc45 57.63,24.45
  Top 0.229: 57.63,24.45 57.63,46.53 arc24 57.4,47.56 v56.83,48.82 | U2.30 53.17,19.99
  Bottom 0.229: IOH.4 33.65,50.72 33.65,50.56 35.72,48.5 54.05,48.5 54.37,48.82 v56.83,48.82
PE1  (via drill 0.5)
  Top 0.203: 52.71,20.49 arc45 54.48,21.22 56.1,22.84 arc45 56.83,24.61
  Top 0.229: 56.83,24.61 56.83,45.17 arc42 56.2,46.83 v55.56,47.55 | U2.31 52.71,20.49
  Bottom 0.229: v55.56,47.55 44.48,47.55 44.25,47.78 33.89,47.78 31.12,50.56 31.12,50.72 IOH.5
PE2  (via drill 0.5)
  Top 0.203: 52.26,20.99 arc45 54.03,21.72 55.47,23.16 arc45 56.2,24.93
  Top 0.229: 56.2,24.93 56.2,43.43 arc47 55.39,45.27 v54.29,46.28 | U2.32 52.26,20.99
  Bottom 0.229: 28.57,50.72 IOH.6 28.5,50.64 30.4,48.74 31.91,48.74 33.58,47.07 43.84,47.07 44.16,46.75 53.82,46.75 v54.29,46.28
PE3  (via drill 0.5)
  Top 0.203: 51.81,21.49 arc45 53.58,22.22 54.83,23.48
  Top 0.229: 54.83,23.48 arc45 55.56,25.24 55.56,41.94 arc55 54.48,44 v53.02,45.01 | v42.99,45.45 42.99,47.4 arc45 41.88,50.06 IOH.1 | U2.33 51.81,21.49
  Bottom 0.229: v53.02,45.01 51.91,45.88 43.51,45.88 v42.99,45.45
PF2
  Top 0.229: PF2.P$1 arc-206 50.18,23.02 50.06,22.99 U2.36
PF3
  Top 0.229: PF3.P$1 arc53 48.16,24.92 48.15,24.82 U2.37
PF4
  Top 0.229: IOL.7 48.18,50.64 48.18,43.28 arc22 49.13,40.56 arc-60 49.05,38.26 arc32 48.74,37.15 48.74,27.78 arc-45 48,26.02 arc45 47.65,25.17 U2.38
PF5  (via drill 0.5)
  Top 0.229: v47.94,39.29 48.1,39.13 48.1,27.94 arc-45 47.37,26.18 arc45 47.15,25.65 U2.39 | v52.39,39.93 arc-45 51.75,41.46 51.75,44.6 arc-45 52.48,46.37 54.83,48.72 arc45 55.56,50.49 IOL.4
  Bottom 0.229: v47.94,39.29 48.58,39.93 v52.39,39.93
TRG_RST  (via drill 0.5, 0.8)  (1 unrouted)
  Top 0.203: 65.72,34.43 v65.72,36.12 | 32.62,2.55 POWER.3 | 20.26,38.02 C16.2 20.45,37.86
  Top 0.229: SPI1.5 63.88,25.89 arc45 64.61,27.66 64.61,31.29 arc-38 65.14,32.82 65.2,32.9 arc38 65.72,34.43 | 29.86,36.18 v29.85,36.19 29.85,22.51 arc46 30.45,21.08 32.97,18.61 arc-46 33.58,17.18 33.58,4.18 arc-45 32.99,2.76 POWER.3 | v46.51,36.12 46.73,35.9 arc-45 47.47,34.13 47.47,28.1 arc-45 47.05,26.73 arc45 46.65,25.74 U2.40
  Top 0.3: D2.A 20.86,36.72 | 20.86,36.72 20.45,37.86 | v29.85,36.19 arc90 29.83,36.21 25.15,36.21 RSTJ1.P$1 | SW2.C2 SW1.P$2 61.69,16.28 61.69,18.9 62.69,22.99 SPI1.5 | RSTJ.P$1 20.98,36.59 20.86,36.72
  Bottom 0.229: v65.72,36.12 v46.51,36.12 v29.85,36.19
UPDI  (via drill 0.5)
  Top 0.203: U2.41 46.15,23.96 arc47 46.85,23.04 v47.23,22.78
  Bottom 0.203: 61.91,24.18 63.18,22.78 UPDI.1
  Bottom 0.229: 61.91,24.18 61.91,26.75 60.88,27.78 60.88,30.48 59.61,31.75 48.18,31.75 47.23,30.8 v47.23,22.78
USB3V
  Bottom 0.203: USBMOD.3V3 USB3V.P$1
VDD  (via drill 0.5)
  Top 0.203: 43.15,15.63 arc-45 42.42,13.87 C11.1 | U2.42 45.65,23.35 v45.72,22.78 | U2.14 43.15,17.2 v43.2,17.58 | D2.C 18.64,35.61 | 52.13,19.05 C12.1
  Top 0.229: C13.2 C14.2 46.05,28.15 arc33 45.65,26.8 U2.42 | U2.14 43.15,15.63 | U2.28 51.24,18.99 | 51.24,18.99 51.93,18.99 arc-45 C12.1 | v51.2,19.05 arc45 51.21,19.02 51.24,18.99
  Top 0.3: 18.64,35.61 arc-45 18.97,34.87 18.65,33.06 arc-53 17.97,31.77 arc-37 16.31,31.35 12.67,31.35 12.47,31.44 12.15,31.76 | 12.15,31.76 | 12.15,31.76 11.91,32 9.13,32 8.49,31.35 7.46,31.35
  Top 0.4: R1.2 6.72,37.08 arc-45 7.3,35.66 7.3,31.51 | 7.3,31.51 JP1.2 | 7.46,31.35 arc-90 7.3,31.51
  Bottom 0.6: v45.72,22.78 43.18,22.78 42.86,22.62 42.86,17.86 43.02,17.7 v43.2,17.58 50.07,17.58 v51.2,19.05 56.83,19.05 58.26,20.4 62.55,20.4 | 62.55,20.4 66.28,20.4 67.47,21.75 | 67.47,22.14 67.47,21.75 | 67.47,21.75 67.55,29.29 66.44,30.4 SPI1.2 | C20.1 62.55,20.4
  Bottom 0.8: C19.1 7.14,24.69 | C21.1 23.81,6.25 25.48,5.16 | C10.1 42.15,7.21 41.84,6.91
  Bottom 1: POWER.2 30,2.47 30,5.24 | POWER.5 37.7,5.16
  Bottom 1.27: JP1.2 7.14,24.69 | 7.14,24.69 7.14,22.94 25,5.24 25.48,5.16 30,5.24 37.7,5.16 40.81,5.16 41.84,6.19 41.84,6.91 41.84,16.21 v43.2,17.58 | 7.14,24.69 arc-90 7.14,24.69
VIN_EXT  (via drill 0.8)
  Top 1: C1.+ arc90 C1.+ v22.47,12.86
  Top 1.27: v38.43,7.94 43.35,7.94 45.42,5.88 45.42,2.49 POWER.8
  Top 1.5: VREG-5V.IN+ arc-67 11.11,15.08 arc12 15,12.14 D1.C arc40 C1.+
  Bottom 0.6: 2.02,16.59 arc-90 VREG-5V.IN+
  Bottom 0.8: C8.1 2.02,16.59
  Bottom 1.27: v22.47,12.86 22.55,11.75 26.28,7.94 v38.43,7.94
VUSB
  Top 0.6: C17.1 14.98,43.16 USBMOD.5V
  Bottom 0.6: C9.1 arc90 9.84,41.69 9.84,43.1
  Bottom 1: JP1.3 4.76,41.75 6.11,43.1 9.84,43.1 USBMOD.5V

### Text on the board
Bottom: PCB by / WestfW
tPlace: 13 | 12 | 11 | 10 | 9 | 8 | 7 | 6 | 5 | 4 | 3 | 2 | 1 | 0
History: 20190814 by WestfW: change to Sparkfun LQFP package | 20190812 by WestfW: Get rid of pull-up resistors on RST and UPDI. | 20190805 by WestfW: Bump to V0.4. Fix reversed rxtx, add xover. Move UPDI pin. | 20190622 by WestfW: v0.2 back from Fab. Fix bottom silkscreen, bump to V0.3 | 20190605 by WestfW: Tag at "Version 0.1", 'publish" at HackADay.io, bump version to 0.2 | 20190603 by WestfW: dual footprints for reset switch. Connect Vin. | 20190602 by WestfW: Add fiducuals. Tweak silkscreen, backside cap packages. | 20190523 by WestfW: remove Aref, add backside bypass caps, simplify RESET | 20190520 by WestfW: Sort-of initial design, culled from UnoWifi2
To-Do: Prettify Silkscreen
_tSilk: L | SCL | SDA | PB3 | 13 | 12 | 11 | 10 | 9 | 8 | 7 | 6 | 5 | 4 | 3 | 2 | 1 | 0 | Digital | PA7 | ON | PA6 | Freeduino 4809 | USBMOD | USB3V | 20p | SPI1 | IN+ | IN- | 4u7 | PSel | VREG-3V3 | USB | OUT- | PA4 | PF3 | 32kHz | IN- | PA5 | PF2 | VREG-5V | UPDI | IN+ | - | OUT+ | OUT+ | OUT- | PC3 | RST | ATMEGA4809 | + | + | + | + | POWER | ANALOG | 6 | RST | 3v3 | +5 | GND | Vin | 0 | AREF | PWR
_bplace: GND | 5V | PA7 | PA6 | TXD | RXD | DTR | RSTJ | 3V3 | Vusb | Copyright 2019 / by Bill Westfield | MISO | +5V | V5reg | SCK | PA4 | PF3 | MOSI | RST | GND | PA5 | PF2 | UPDI | http://hackaday.io/project/165661 | Vdd Core | Vin | V3.3reg | PC3 | Vdd Core